# EAGLE design interfaceModule (EAGLE 9.3.1)
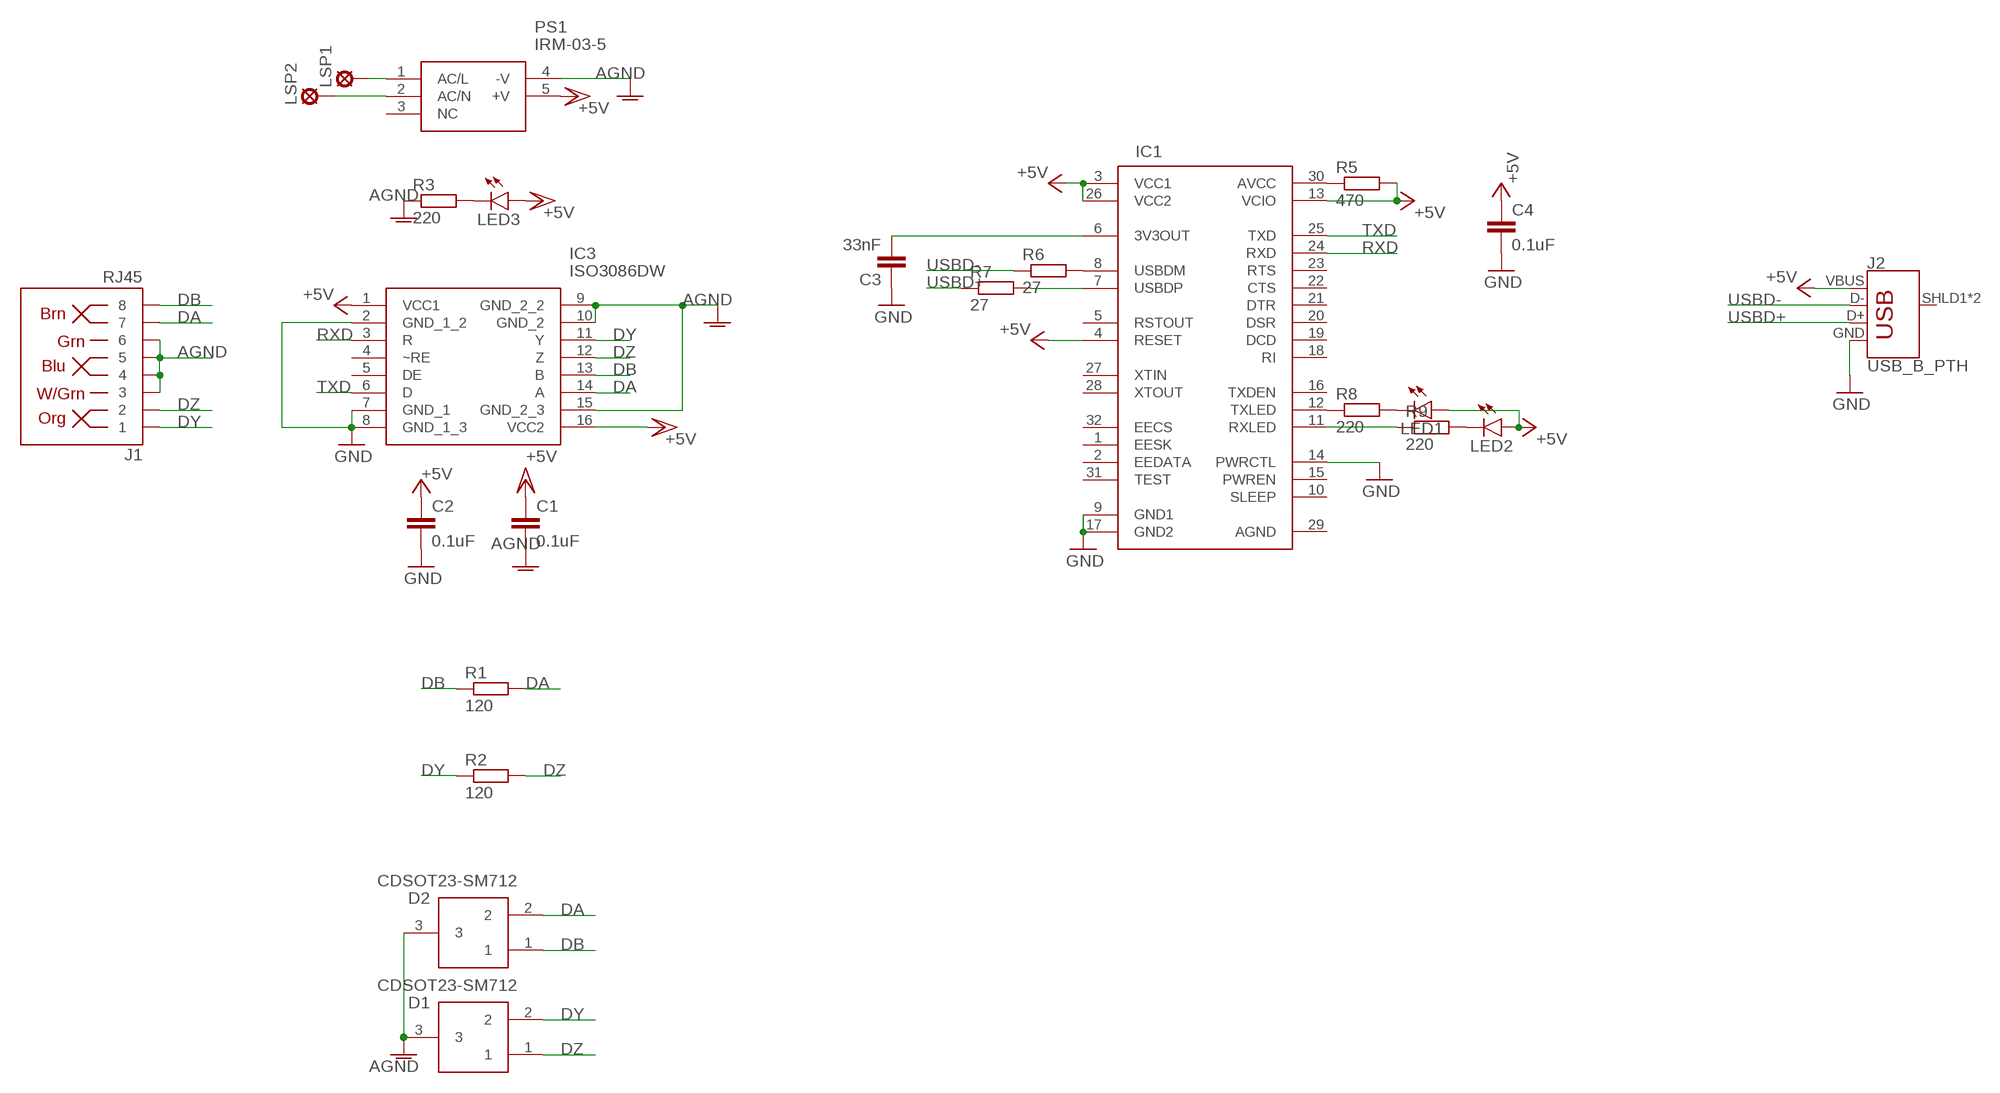
[diagram p0: schematic, sheet 1]

## Parts
C1  0.1uF  C-EUC0603  [C0603]
C2  0.1uF  C-EUC0603  [C0603]
C3  33nF  C-EUC0603  [C0603]
C4  0.1uF  C-EUC0603  [C0603]
D1  CDSOT23-SM712  [SOT95P230X117-3N]
D2  CDSOT23-SM712  [SOT95P230X117-3N]
IC1  FT232BM  [QFP-32]
IC3  ISO3086DW  [SOIC127P1030X265-16N]
J1  RJ45  RJ45-8  [RJ45-8]
J2  USB_B_PTH  [USB-B-PTH]
LED1  LEDSML1206  [SML1206]
LED2  LEDSML1206  [SML1206]
LED3  LEDSML1206  [SML1206]
LSP1  SE14  [SE14]
LSP2  SE14  [SE14]
PS1  IRM-03-5  [IRM0312]
R1  120  R-EU_R1210  [R1210]
R2  120  R-EU_R1210  [R1210]
R3  220  R-EU_R0805  [R0805]
R5  470  R-EU_R0805  [R0805]
R6  27  R-EU_R0805  [R0805]
R7  27  R-EU_R0805  [R0805]
R8  220  R-EU_R0805  [R0805]
R9  220  R-EU_R0805  [R0805]

## Nets
+5V: C2.1 C4.1 IC1.3(VCC1) IC1.4(RESET) IC1.13(VCIO) IC1.26(VCC2) IC3.1(VCC1) J2.VBUS LED1.A LED2.A R5.2
AGND: C1.2 D1.3 D2.3 IC3.9(GND_2_2) IC3.10(GND_2) IC3.15(GND_2_3) J1.3 J1.4 J1.5 J1.6 PS1.4(-V) R3.1
DA: D2.2 IC3.14(A) J1.7 R1.2
DB: D2.1 IC3.13(B) J1.8 R1.1
DY: D1.2 IC3.11(Y) J1.1 R2.1
DZ: D1.1 IC3.12(Z) J1.2 R2.2
GND: C2.2 C3.1 C4.2 IC1.9(GND1) IC1.14(PWRCTL) IC1.17(GND2) IC3.2(GND_1_2) IC3.7(GND_1) IC3.8(GND_1_3) J2.GND
N$1: LSP1.MP PS1.1(AC/L)
N$2: LSP2.MP PS1.2(AC/N)
N$3: IC1.8(USBDM) R6.2
N$4: IC1.30(AVCC) R5.1
N$5: IC1.7(USBDP) R7.2
N$6: C3.2 IC1.6(3V3OUT)
N$7: IC1.12(TXLED) R8.1
N$8: IC1.11(RXLED) R9.1
N$9: LED2.C R9.2
N$10: LED1.C R8.2
N$11: LED3.C R3.2
RXD: IC1.24(RXD) IC3.3(R)
TXD: IC1.25(TXD) IC3.6(D)
USBD+: J2.D+ R7.1
USBD-: J2.D- R6.1
VCC/2: C1.1 IC3.16(VCC2) LED3.A PS1.5(+V) ; supply symbol labelled +5V
Unconnected: IC1.1(EESK) IC1.2(EEDATA) IC1.5(RSTOUT) IC1.10(SLEEP) IC1.15(PWREN) IC1.16(TXDEN) IC1.18(RI) IC1.19(DCD) IC1.20(DSR) IC1.21(DTR) IC1.22(CTS) IC1.23(RTS) IC1.27(XTIN) IC1.28(XTOUT) IC1.29(AGND) IC1.31(TEST) IC1.32(EECS) IC3.4(~RE) IC3.5(DE) J2.SHLD1(SHIELD) J2.SHLD2(SHIELD) PS1.3(NC)

## Library data of the parts
C1-C4 = rcl:C-EU: CAPACITOR, European symbol; SPICEPREFIX: C
D1 D2 = SamacSys_Parts:CDSOT23-SM712: TVS Diode Dual Bi-Dir 7/12V 30KV SOT23 Bourns CDSOT23-SM712 Dual Bi-Directional TVS Diode, 400W peak, 3-Pin SOT-23 Source: Datasheet <https://componentsearchengine.com/Datasheets/1/CDSOT23-SM712.pdf>; DESCRIPTION: TVS Diode Dual Bi-Dir 7/12V 30KV SOT23 Bourns CDSOT23-SM712 Dual Bi-Directional TVS Diode, 400W peak, 3-Pin SOT-23; HEIGHT: 1.17mm; MANUFACTURER_NAME: Bourns; MANUFACTURER_PART_NUMBER: CDSOT23-SM712; MOUSER_PART_NUMBER: 652-CDSOT23-SM712; MOUSER_PRICE-STOCK: https://www.mouser.com/Search/Refine.aspx?Keyword=652-CDSOT23-SM712
IC1 = FTDI:FT232BM: FT232BM USB-RS232 Wandler FTDI
IC3 = SamacSys_Parts:ISO3086DW: ISOLATED 5-V FULL AND HALF-DUPLEX RS-485 TRANSCEIVERS Source: Datasheet <http://www.ti.com/lit/gpn/iso3086>; DESCRIPTION: ISOLATED 5-V FULL AND HALF-DUPLEX RS-485 TRANSCEIVERS; HEIGHT: mm; MANUFACTURER_NAME: Texas Instruments; MANUFACTURER_PART_NUMBER: ISO3086DW; MOUSER_PART_NUMBER: 595-ISO3086DW; MOUSER_PRICE-STOCK: https://www.mouser.com/Search/Refine.aspx?Keyword=595-ISO3086DW
J1 = SparkFun-Connectors:RJ45-8: RJ45 Jack - 8 pin Simple RJ45, 8-pin connection. Commonly used for Cat5, Cat5e, and Cat6 Ethernet cables. Here is the connector we sell at SparkFun: RJ45 8-Pin Connector <https://www.sparkfun.com/products/643> (PRT-00643) Datasheet <https://cdn.sparkfun.com/datasheets/Prototyping/04908.pdf> It is used on this SparkFun product: SparkFun RJ45 Breakout <https://www.sparkfun.com/products/716> (BOB-00716) Note, you may also be interested in the "MAGJACK" version of this. It is basically a RJ45 connector, but also has some status LEDs built into the connector housing. You can check that out in this library at the device named "MAGJACK.dev" and see these products online: RJ45 Ethernet MagJack-Compatible <https://www.sparkfun.com/products/8534> (PRT-08534) SparkFun RJ45 MagJack Breakout <https://www.sparkfun.com/products/13021> (BOB-13021); PROD_ID: CONN-08506; SF_ID: PRT-00643
J2 = SparkFun-Connectors:USB_B: USB Type B Connector SparkFun Products: SparkFun Stepoko <https://www.sparkfun.com/products/13899> PTH; PROD_ID: CONN-08278; SF_ID: PRT-00139
LED1-LED3 = led:LED: LED OSRAM: - CHIPLED LG R971, LG N971, LY N971, LG Q971, LY Q971, LO R971, LY R971 LH N974, LH R974 LS Q976, LO Q976, LY Q976 LO Q996 - Hyper CHIPLED LW Q18S LB Q993, LB Q99A, LB R99A - SideLED LS A670, LO A670, LY A670, LG A670, LP A670 LB A673, LV A673, LT A673, LW A673 LH A674 LY A675 LS A676, LA A676, LO A676, LY A676, LW A676 LS A679, LY A679, LG A679 - Hyper Micro SIDELED® LS Y876, LA Y876, LO Y876, LY Y876 LT Y87S - SmartLED LW L88C, LW L88S LB L89C, LB L89S, LG L890 LS L89K, LO L89K, LY L89K LS L896, LA L896, LO L896, LY L896 - TOPLED LS T670, LO T670, LY T670, LG T670, LP T670 LSG T670, LSP T670, LSY T670, LOP T670, LYG T670 LG T671, LOG T671, LSG T671 LB T673, LV T673, LT T673, LW T673 LH T674 LS T676, LA T676, LO T676, LY T676, LB T676, LH T676, LSB T676, LW T676 LB T67C, LV T67C, LT T67C, LS T67K, LO T67K, LY T67K, LW E67C LS E67B, LA E67B, LO E67B, LY E67B, LB E67C, LV E67C, LT E67C LW T67C LS T679, LY T679, LG T679 LS T770, LO T770, LY T770, LG T770, LP T770 LB T773, LV T773, LT T773, LW T773 LH T774 LS E675, LA E675, LY E675, LS T675 LS T776, LA T776, LO T776, LY T776, LB T776 LHGB T686 LT T68C, LB T68C - Hyper Mini TOPLED® LB M676 - Mini TOPLED Santana® LG M470 LS M47K, LO M47K, LY M47K Source: http://www.osram.convergy.de LUXEON: - LUMILED® LXK2-PW12-R00, LXK2-PW12-S00, LXK2-PW14-U00, LXK2-PW14-V00 LXK2-PM12-R00, LXK2-PM12-S00, LXK2-PM14-U00 LXK2-PE12-Q00, LXK2-PE12-R00, LXK2-PE12-S00, LXK2-PE14-T00, LXK2-PE14-U00 LXK2-PB12-K00, LXK2-PB12-L00, LXK2-PB12-M00, LXK2-PB14-N00, LXK2-PB14-P00, LXK2-PB14-Q00 LXK2-PR12-L00, LXK2-PR12-M00, LXK2-PR14-Q00, LXK2-PR14-R00 LXK2-PD12-Q00, LXK2-PD12-R00, LXK2-PD12-S00 LXK2-PH12-R00, LXK2-PH12-S00 LXK2-PL12-P00, LXK2-PL12-Q00, LXK2-PL12-R00 Source: www.luxeon.com KINGBRIGHT: KA-3528ASYC Source: www.kingbright.com
LSP1 LSP2 = solpad:SE14: SOLDER PAD E1553, drill 1,4mm, distributor Buerklin, 07F820
PS1 = SamacSys_Parts:IRM-03-5: Mean Well 3W Encapsulated Switch Mode Power Supply, 0 600mA, 5V dc Source: Datasheet <https://www.meanwell.com/Upload/PDF/IRM-03/IRM-03-SPEC.PDF>; DESCRIPTION: Mean Well 3W Encapsulated Switch Mode Power Supply, 0 600mA, 5V dc; HEIGHT: mm; MANUFACTURER_NAME: Mean Well; MANUFACTURER_PART_NUMBER: IRM-03-5; MOUSER_PART_NUMBER: 709-IRM03-5; MOUSER_PRICE-STOCK: https://www.mouser.com/Search/Refine.aspx?Keyword=709-IRM03-5
R1-R3 R5-R9 = rcl:R-EU_: RESISTOR, European symbol; SPICEPREFIX: R

## Board
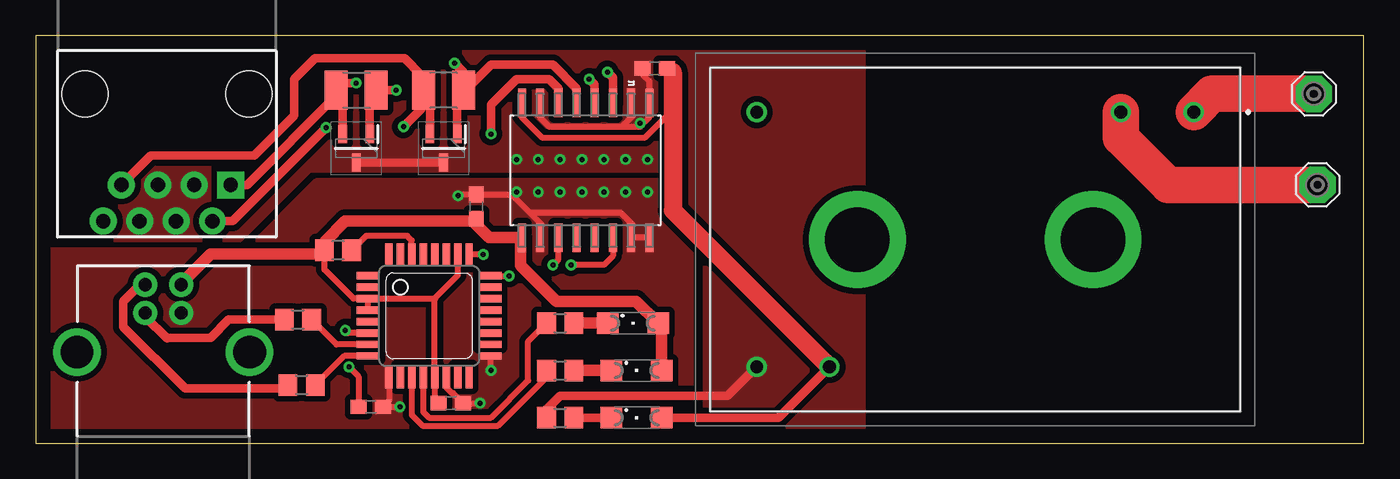
[diagram p1: board, top side]
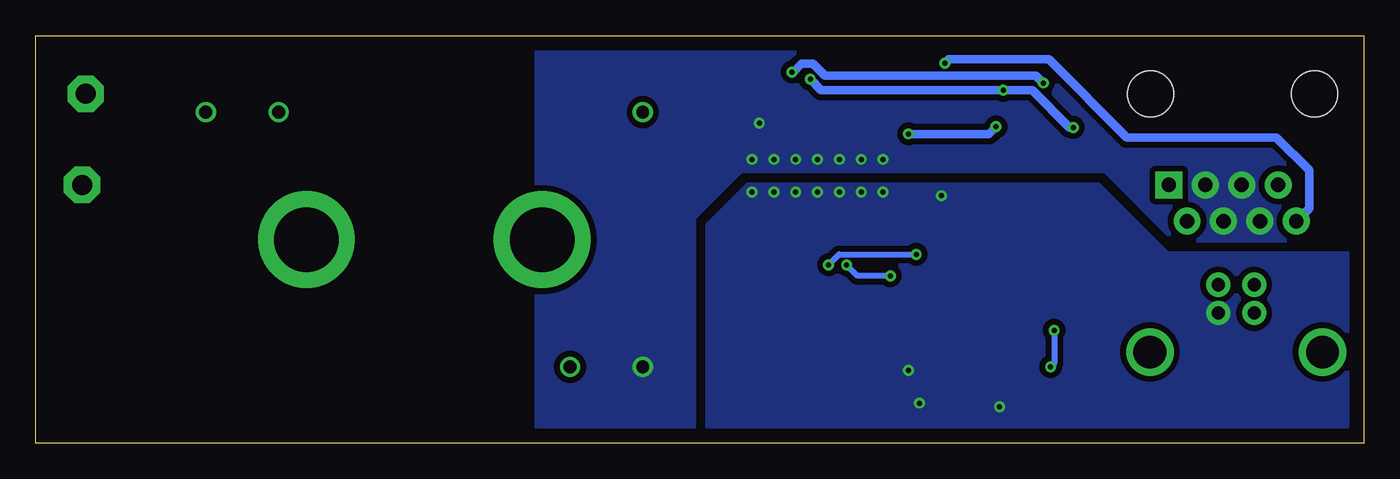
[diagram p2: board, bottom side, seen from below]

Size 92.63 x 28.44 mm. Coordinates in mm from the lower left corner, seen from the top.
Outline: 0,0 92.63,0 92.63,28.44 0,28.44 0,0
Copper layers (1*16): Top 0.035mm / dielectric 1.5mm / Bottom 0.035mm
Design rules "default *": minimum track width 6mil, minimum drill 0.35mm, track to track 6mil, track to pad 6mil, pad to pad 6mil, via to via 6mil, smd to smd 6mil, copper to edge 40mil, drill to drill 6mil, minimum pad ring 10mil, minimum via ring 8mil, stop-mask expansion 4mil, vias tented up to drill 20mil, thermal gap 10mil

### Footprints (pad centres in the part's own frame; a part is rotated, then mirrored left to right if it is on the bottom)
C0603 = smd 1.1 x 1: 1 -0.85,0; 2 0.85,0
SOT95P230X117-3N = smd 1.25 x 0.6: 1 -1,0.95; 2 -1,-0.95; 3 1,0
QFP-32 = smd 0.508 x 1.6: 1 -2.8,-4.25; 2 -2,-4.25; 3 -1.2,-4.25; 4 -0.4,-4.25; 5 0.4,-4.25; 6 1.2,-4.25; 7 2,-4.25; 8 2.8,-4.25; 17 2.8,4.25; 18 2,4.25; 19 1.2,4.25; 20 0.4,4.25; 21 -0.4,4.25; 22 -1.2,4.25; 23 -2,4.25; 24 -2.8,4.25 | smd 1.6 x 0.508: 9 4.25,-2.8; 10 4.25,-2; 11 4.25,-1.2; 12 4.25,-0.4; 13 4.25,0.4; 14 4.25,1.2; 15 4.25,2; 16 4.25,2.8; 25 -4.25,2.8; 26 -4.25,2; 27 -4.25,1.2; 28 -4.25,0.4; 29 -4.25,-0.4; 30 -4.25,-1.2; 31 -4.25,-2; 32 -4.25,-2.8
SOIC127P1030X265-16N = smd 1.981 x 0.559: 1 -4.699,4.445; 2 -4.699,3.175; 3 -4.699,1.905; 4 -4.699,0.635; 5 -4.699,-0.635; 6 -4.699,-1.905; 7 -4.699,-3.175; 8 -4.699,-4.445; 9 4.699,-4.445; 10 4.699,-3.175; 11 4.699,-1.905; 12 4.699,-0.635; 13 4.699,0.635; 14 4.699,1.905; 15 4.699,3.175; 16 4.699,4.445
RJ45-8 = drill 1 pad 1.88 square: 1 -4.445,6.35 | drill 1 pad 1.88: 2 -3.175,8.89; 3 -1.905,6.35; 4 -0.635,8.89; 5 0.635,6.35; 6 1.905,8.89; 7 3.175,6.35; 8 4.445,8.89 | hole 3.2: -5.715,0; 5.715,0
USB-B-PTH = drill 0.914 pad 1.676: D+ 4,1.25; D- 5.981,1.25; GND 4,-1.25; VBUS 5.981,-1.25 | drill 2.286: SHLD1 1.282,-6.02; SHLD2 1.282,6.02
SML1206 = smd 1.5 x 1.5: A 1.75,0; C -1.75,0
SE14 = drill 1.397 pad 2.54 octagon: MP 0,0
IRM0312 = drill 0.9 pad 1.4: 1 0,0; 2 5.08,0; 3 30.48,0; 4 30.48,17.78; 5 25.4,17.78 | drill 4.5 pad 6.75: 6 7.02,8.9; 7 23.46,8.9
R1210 = smd 1.6 x 2.7: 1 -1.4,0; 2 1.4,0
R0805 = smd 1.3 x 1.5: 1 -0.95,0; 2 0.95,0

### Placement (x,y rotation side)
C1  43.18,26.16 180 top
C2  30.73,16.51 90 top
C3  23.37,2.54 180 top
C4  28.96,2.79 0 top
D1  22.35,20.57 270 top
D2  28.45,20.57 270 top
IC1  27.43,8.89 270 top
IC3  38.35,19.05 90 top
J1  9.14,24.38 180 top
J2  8.89,5.08 90 top
LED1  41.66,8.38 0 top
LED2  41.91,5.08 0 top
LED3  41.91,1.78 0 top
LSP1  89.15,24.38 0 top
LSP2  89.41,18.03 0 top
PS1  80.77,23.11 180 top
R1  28.45,24.64 180 top
R2  22.35,24.64 0 top
R3  36.58,1.78 0 top
R5  21.08,13.46 180 top
R6  18.54,4.06 0 top
R7  18.29,8.64 0 top
R8  36.58,8.38 0 top
R9  36.58,5.08 0 top

### Tracks (layer width: path | path; a pad name or v marks a point on that pad's centre or on a via)
+5V
  Top 0.305: C2.1 30.65,15.66 30.48,15.49
  Top 0.406: IC1.4 IC1.3 | C4.1 27.83,3.07 IC1.13 27.83,10.05 27.87,10.09 | 33.82,14.35 IC3.1 | IC1.3 22.17,10.09 20.13,12.13 R5.2 | IC1.3 27.87,10.09 | IC1.26 29.43,11.72 27.87,10.15 27.87,10.09
  Top 0.813: J2.VBUS 10.14,11.16 12.19,13.21 19.88,13.21 R5.2 20.13,14.04 21.59,15.49 30.48,15.49 31.62,14.35 33.82,14.35 33.82,12.41 36.32,9.91 41.88,9.91 LED1.A 43.66,8.13 LED2.A
AGND  (via drill 0.35)
  Top 0.406: IC3.15 35.18,22.73 35.81,22.1 40.89,22.1 | 40.89,22.1 41.66,22.86 41.53,22.99 IC3.10 | 40.89,22.1 42.16,22.1 42.8,22.73 IC3.9 42.8,25.27 42.33,25.74 C1.2
  Top 0.61: D2.3 D1.3 | R3.1 35.63,2.35 36.58,3.3 48.26,3.3 PS1.4
  other vias: 42.67,19.81 41.15,19.81 39.62,19.81 38.1,19.81 36.58,19.81 35.05,19.81 33.53,19.81 42.16,22.35
  pour Bottom (isolate 0.406, no thermals): 0,27.94 57.66,27.94 57.66,0.25 46.74,0.25 46.74,15.75 43.43,19.05 18.03,19.05 13.21,14.22 0,14.22
  pour Top (isolate 0.406, no thermals): 0,27.94 57.66,27.94 57.66,0.25 46.74,0.25 46.74,15.49 45.47,16.76 45.47,19.05 19.05,19.05 14.22,14.22 0,14.22
DA  (via drill 0.35)
  Top 0.305: R1.2 26.92,24.51 26.92,23.88
  Top 0.61: IC3.14 36.45,24.77 35.81,25.4 33.53,25.4 31.75,23.62 v31.75,21.59 | J1.7 8,20.07 15.24,20.07 18.03,22.86 18.03,25.4 19.5,26.86 25.71,26.86 26.92,25.65 26.92,23.88 26.92,23.67 | D2.2 27.5,23.67 26.92,23.67 | 26.92,23.67 26.92,23.37 v25.65,22.1
  Bottom 0.61: v31.75,21.59 26.16,21.59 v25.65,22.1
DB  (via drill 0.35)
  Top 0.61: IC3.13 37.72,24.77 36.07,26.42 31.75,26.42 29.97,24.64 | 29.97,24.64 R1.1 29.85,25.9 v29.21,26.54 | D2.1 29.4,23.61 29.97,24.18 29.97,24.64
  Bottom 0.61: v29.21,26.54 28.96,26.79 21.96,26.79 16.51,21.34 6.1,21.34 3.81,19.05 3.81,16.38 J1.8
DY  (via drill 0.35)
  Top 0.61: IC3.11 40.26,25.53 v39.88,25.91 | 20.95,24.25 R2.1 21.46,25.15 v22.35,25.15 | 20.95,24.25 21.21,24.51 21.21,23.8 21.4,23.61 D1.2 | 20.95,24.25 14.73,18.03 J1.1
  Bottom 0.61: v39.88,25.91 39.79,25.91 39.21,26.49 38.43,26.49 37.59,25.65 22.86,25.65 v22.35,25.15
DZ  (via drill 0.35)
  Top 0.61: IC3.12 38.99,25.02 v38.61,25.4 | v25.15,24.64 R2.2 23.3,24.19 D1.1 | v20.26,22.04 13.72,15.49 J1.2
  Bottom 0.61: v38.61,25.4 37.85,24.64 v25.15,24.64 23.11,24.64 20.52,22.04 v20.26,22.04
GND  (via drill 0.35)
  Top 0.406: IC1.9 24.63,2.95 C3.1 v25.4,2.54 | IC1.14 28.63,3.88 29.03,3.48 29.12,3.48 C4.2 v30.99,2.79 | 34.46,16.09 33.19,17.36 C2.2 29.55,17.36 v29.46,17.27 | 34.46,16.09 35.31,15.24 35.18,15.11 IC3.2 | IC3.8 IC3.7 41.53,15.11 41.66,15.24 40.81,16.09 34.46,16.09 | IC1.17 31.68,5.08 v31.75,5.08
  other vias: 33.53,17.53 35.05,17.53 36.58,17.53 38.1,17.53 39.62,17.53 41.15,17.53 42.67,17.53
  pour Bottom (isolate 0.406, no thermals): 0,0 45.72,0 45.72,15.24 42.93,18.03 18.54,18.03 13.72,13.21 0,13.21
  pour Top (isolate 0.406, no thermals): 0,0 45.72,0 45.72,14.99 43.69,17.02 43.69,18.29 19.56,18.29 14.73,13.46 0,13.46
N$1
  Top 2.54: LSP1.MP 82.04,24.38 PS1.1
N$2
  Top 2.54: PS1.2 75.69,21.34 78.99,18.03 LSP2.MP
N$3
  Top 0.406: IC1.8 21.52,6.09 R6.2
N$4
  Top 0.406: IC1.30 26.23,14.15 25.91,14.48 23.05,14.48 R5.1
N$5
  Top 0.406: IC1.7 20.98,6.89 R7.2
N$6  (via drill 0.35)
  Top 0.406: IC1.6 21.77,7.69 v21.59,7.87 | v21.84,5.33 22.52,4.66 C3.2
  Bottom 0.406: v21.59,7.87 21.59,5.59 v21.84,5.33
N$7
  Top 0.406: R8.1 34.36,7.11 34.36,4.38 31.75,1.78 27.43,1.78 27.03,2.18 IC1.12
N$8
  Top 0.406: R9.1 35.63,4.61 32.23,1.22 26.98,1.22 26.23,1.96 IC1.11
N$9
  Top 0.813: LED2.C R9.2
N$10
  Top 0.813: R8.2 LED1.C
N$11
  Top 0.61: R3.2 LED3.C
RXD  (via drill 0.35)
  Top 0.406: IC1.24 v33.02,11.69 v33.02,11.68 | v36.07,12.45 36.45,12.83 IC3.3
  Bottom 0.406: v33.02,11.68 35.31,11.68 v36.07,12.45
TXD  (via drill 0.35)
  Top 0.406: IC3.6 40.26,13.08 39.62,12.45 v37.34,12.45 | v31.21,13.18 30.27,13.18 IC1.25
  Bottom 0.406: v37.34,12.45 36.6,13.18 v31.21,13.18
USBD+
  Top 0.61: J2.D+ 7.64,8.83 9.16,7.3 9.16,7.37 12.19,7.37 13.46,8.64 R7.1
USBD-
  Top 0.61: R6.1 17.34,3.81 10.41,3.81 6.1,8.13 6.1,9.91 7.25,11.06 J2.D-
VCC/2
  Top 0.305: C1.1 44.2,26.16 44.45,25.91
  Top 0.406: IC3.16 33.91,22.73 35.31,21.34 42.51,21.34 44.03,22.86 C1.1
  Top 0.61: LED3.A 51.82,1.78 PS1.5
  Top 1.27: PS1.5 44.45,16.26 44.45,25.91